# Altium schematic sheet SUMMARY.SchDoc: SUMMARY
size A4; Author: Joao Guimaraes; Organization: Altium Limited; Address1: L3, 12a Rodborough Rd; Address2: Frenchs Forest; Address3: NSW; Address4: Australia 2086; Revision: 1.0.0; SheetNumber: 1
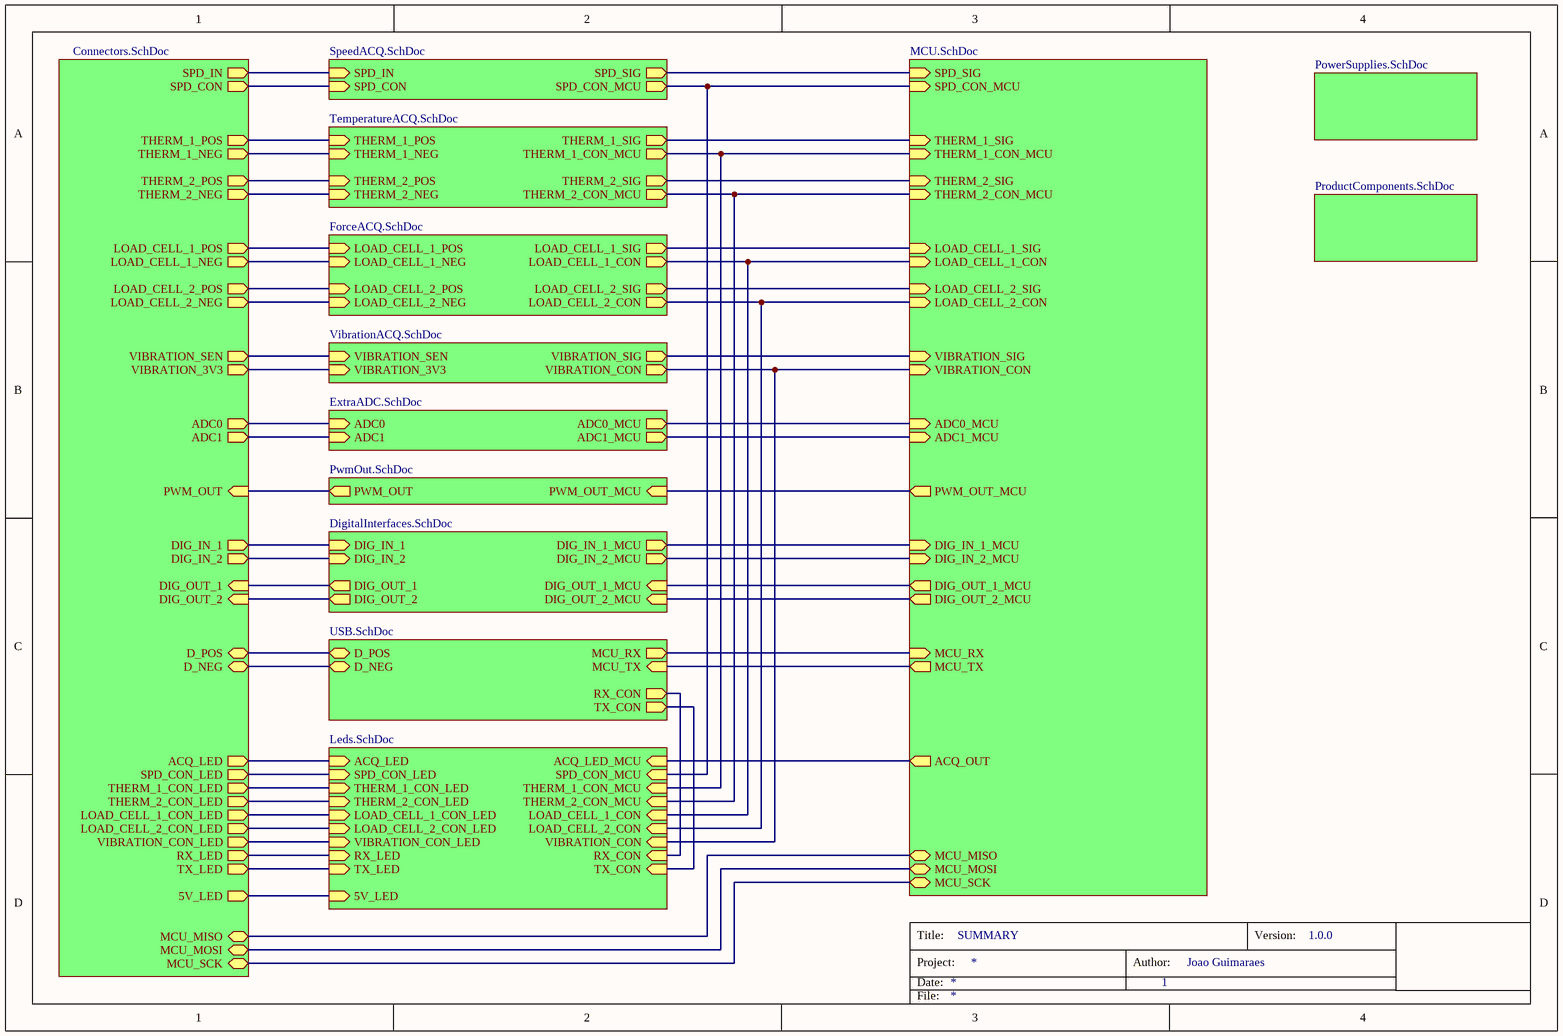
[diagram p0: SUMMARY.SchDoc]

## Sub-sheets
Connectors = Connectors.SchDoc: SPD_IN (out), SPD_CON (out), THERM_1_POS (out), THERM_1_NEG (out), THERM_2_POS (out), THERM_2_NEG (out), LOAD_CELL_1_POS (out), LOAD_CELL_1_NEG (out), LOAD_CELL_2_POS (out), LOAD_CELL_2_NEG (out), VIBRATION_SEN (out), VIBRATION_3V3 (out), DIG_IN_1 (out), DIG_IN_2 (out), DIG_OUT_1 (in), DIG_OUT_2 (in), D_POS, D_NEG, MCU_MISO, MCU_MOSI, MCU_SCK, ACQ_LED (out), RX_LED (out), SPD_CON_LED (out), THERM_1_CON_LED (out), THERM_2_CON_LED (out), LOAD_CELL_1_CON_LED (out), LOAD_CELL_2_CON_LED (out), VIBRATION_CON_LED (out), TX_LED (out), ADC1 (out), PWM_OUT (in), ADC0 (out), 5V_LED (out)
Designator = ExtraADC.SchDoc: ADC0 (in), ADC1 (in), ADC0_MCU (out), ADC1_MCU (out)
DigitalIntefaces = DigitalInterfaces.SchDoc: DIG_IN_1 (in), DIG_IN_2 (in), DIG_OUT_1 (out), DIG_OUT_2 (out), DIG_IN_1_MCU (out), DIG_IN_2_MCU (out), DIG_OUT_1_MCU (in), DIG_OUT_2_MCU (in)
ForceACQ = ForceACQ.SchDoc: LOAD_CELL_1_POS (in), LOAD_CELL_1_NEG (in), LOAD_CELL_2_POS (in), LOAD_CELL_2_NEG (in), LOAD_CELL_1_CON (out), LOAD_CELL_1_SIG (out), LOAD_CELL_2_SIG (out), LOAD_CELL_2_CON (out)
Leds = Leds.SchDoc: ACQ_LED_MCU (in), SPD_CON_MCU (in), THERM_1_CON_MCU (in), THERM_2_CON_MCU (in), LOAD_CELL_1_CON (in), LOAD_CELL_2_CON (in), VIBRATION_CON (in), ACQ_LED (in), SPD_CON_LED (in), THERM_1_CON_LED (in), THERM_2_CON_LED (in), LOAD_CELL_1_CON_LED (in), LOAD_CELL_2_CON_LED (in), VIBRATION_CON_LED (in), RX_CON (in), TX_CON (in), RX_LED (in), TX_LED (in), 5V_LED (in)
MCU = MCU.SchDoc: SPD_SIG (in), SPD_CON_MCU (in), THERM_1_SIG (in), THERM_1_CON_MCU (in), THERM_2_SIG (in), THERM_2_CON_MCU (in), LOAD_CELL_1_SIG (in), LOAD_CELL_1_CON (in), LOAD_CELL_2_SIG (in), LOAD_CELL_2_CON (in), VIBRATION_SIG (in), VIBRATION_CON (in), PWM_OUT_MCU (out), DIG_IN_1_MCU (in), DIG_IN_2_MCU (in), DIG_OUT_1_MCU (out), DIG_OUT_2_MCU (out), MCU_RX (in), MCU_TX (out), MCU_MISO, MCU_MOSI, MCU_SCK, ACQ_OUT (out), ADC0_MCU (in), ADC1_MCU (in)
PowerSupplies = PowerSupplies.SchDoc: no entries
ProductComponents = ProductComponents.SchDoc: no entries
PwmOut = PwmOut.SchDoc: PWM_OUT_MCU (in), PWM_OUT (out)
SpeedACQ = SpeedACQ.SchDoc: SPD_IN (in), SPD_SIG (out), SPD_CON_MCU (out), SPD_CON (in)
TemperatureACQ = TemperatureACQ.SchDoc: THERM_1_NEG (in), THERM_2_POS (in), THERM_2_NEG (in), THERM_1_POS (in), THERM_1_SIG (out), THERM_1_CON_MCU (out), THERM_2_SIG (out), THERM_2_CON_MCU (out)
USB = USB.SchDoc: D_POS, D_NEG, MCU_RX (out), MCU_TX (in), RX_CON (out), TX_CON (out)
VibrationACQ = VibrationACQ.SchDoc: VIBRATION_SEN (in), VIBRATION_3V3 (in), VIBRATION_SIG (out), VIBRATION_CON (out)

## Nets
(unnamed): sheet TemperatureACQ/THERM_1_NEG, sheet Connectors/THERM_1_NEG
(unnamed): sheet TemperatureACQ/THERM_2_POS, sheet Connectors/THERM_2_POS
(unnamed): sheet TemperatureACQ/THERM_2_NEG, sheet Connectors/THERM_2_NEG
(unnamed): sheet TemperatureACQ/THERM_1_POS, sheet Connectors/THERM_1_POS
(unnamed): sheet TemperatureACQ/THERM_1_SIG, sheet MCU/THERM_1_SIG
(unnamed): sheet TemperatureACQ/THERM_1_CON_MCU, sheet MCU/THERM_1_CON_MCU, sheet Leds/THERM_1_CON_MCU
(unnamed): sheet TemperatureACQ/THERM_2_SIG, sheet MCU/THERM_2_SIG
(unnamed): sheet TemperatureACQ/THERM_2_CON_MCU, sheet MCU/THERM_2_CON_MCU, sheet Leds/THERM_2_CON_MCU
(unnamed): sheet ForceACQ/LOAD_CELL_1_POS, sheet Connectors/LOAD_CELL_1_POS
(unnamed): sheet ForceACQ/LOAD_CELL_1_NEG, sheet Connectors/LOAD_CELL_1_NEG
(unnamed): sheet ForceACQ/LOAD_CELL_2_POS, sheet Connectors/LOAD_CELL_2_POS
(unnamed): sheet ForceACQ/LOAD_CELL_2_NEG, sheet Connectors/LOAD_CELL_2_NEG
(unnamed): sheet ForceACQ/LOAD_CELL_1_CON, sheet MCU/LOAD_CELL_1_CON, sheet Leds/LOAD_CELL_1_CON
(unnamed): sheet ForceACQ/LOAD_CELL_1_SIG, sheet MCU/LOAD_CELL_1_SIG
(unnamed): sheet ForceACQ/LOAD_CELL_2_SIG, sheet MCU/LOAD_CELL_2_SIG
(unnamed): sheet ForceACQ/LOAD_CELL_2_CON, sheet MCU/LOAD_CELL_2_CON, sheet Leds/LOAD_CELL_2_CON
(unnamed): sheet VibrationACQ/VIBRATION_SEN, sheet Connectors/VIBRATION_SEN
(unnamed): sheet VibrationACQ/VIBRATION_3V3, sheet Connectors/VIBRATION_3V3
(unnamed): sheet VibrationACQ/VIBRATION_SIG, sheet MCU/VIBRATION_SIG
(unnamed): sheet VibrationACQ/VIBRATION_CON, sheet MCU/VIBRATION_CON, sheet Leds/VIBRATION_CON
(unnamed): sheet SpeedACQ/SPD_IN, sheet Connectors/SPD_IN
(unnamed): sheet SpeedACQ/SPD_SIG, sheet MCU/SPD_SIG
(unnamed): sheet SpeedACQ/SPD_CON_MCU, sheet MCU/SPD_CON_MCU, sheet Leds/SPD_CON_MCU
(unnamed): sheet SpeedACQ/SPD_CON, sheet Connectors/SPD_CON
(unnamed): sheet MCU/PWM_OUT_MCU, sheet PwmOut/PWM_OUT_MCU
(unnamed): sheet MCU/DIG_IN_1_MCU, sheet DigitalIntefaces/DIG_IN_1_MCU
(unnamed): sheet MCU/DIG_IN_2_MCU, sheet DigitalIntefaces/DIG_IN_2_MCU
(unnamed): sheet MCU/DIG_OUT_1_MCU, sheet DigitalIntefaces/DIG_OUT_1_MCU
(unnamed): sheet MCU/DIG_OUT_2_MCU, sheet DigitalIntefaces/DIG_OUT_2_MCU
(unnamed): sheet MCU/MCU_RX, sheet USB/MCU_RX
(unnamed): sheet MCU/MCU_TX, sheet USB/MCU_TX
(unnamed): sheet MCU/MCU_MISO, sheet Connectors/MCU_MISO
(unnamed): sheet MCU/MCU_MOSI, sheet Connectors/MCU_MOSI
(unnamed): sheet MCU/MCU_SCK, sheet Connectors/MCU_SCK
(unnamed): sheet MCU/ACQ_OUT, sheet Leds/ACQ_LED_MCU
(unnamed): sheet MCU/ADC0_MCU, sheet Designator/ADC0_MCU
(unnamed): sheet MCU/ADC1_MCU, sheet Designator/ADC1_MCU
(unnamed): sheet PwmOut/PWM_OUT, sheet Connectors/PWM_OUT
(unnamed): sheet DigitalIntefaces/DIG_IN_1, sheet Connectors/DIG_IN_1
(unnamed): sheet DigitalIntefaces/DIG_IN_2, sheet Connectors/DIG_IN_2
(unnamed): sheet DigitalIntefaces/DIG_OUT_1, sheet Connectors/DIG_OUT_1
(unnamed): sheet DigitalIntefaces/DIG_OUT_2, sheet Connectors/DIG_OUT_2
(unnamed): sheet Connectors/D_POS, sheet USB/D_POS
(unnamed): sheet Connectors/D_NEG, sheet USB/D_NEG
(unnamed): sheet Connectors/ACQ_LED, sheet Leds/ACQ_LED
(unnamed): sheet Connectors/RX_LED, sheet Leds/RX_LED
(unnamed): sheet Connectors/SPD_CON_LED, sheet Leds/SPD_CON_LED
(unnamed): sheet Connectors/THERM_1_CON_LED, sheet Leds/THERM_1_CON_LED
(unnamed): sheet Connectors/THERM_2_CON_LED, sheet Leds/THERM_2_CON_LED
(unnamed): sheet Connectors/LOAD_CELL_1_CON_LED, sheet Leds/LOAD_CELL_1_CON_LED
(unnamed): sheet Connectors/LOAD_CELL_2_CON_LED, sheet Leds/LOAD_CELL_2_CON_LED
(unnamed): sheet Connectors/VIBRATION_CON_LED, sheet Leds/VIBRATION_CON_LED
(unnamed): sheet Connectors/TX_LED, sheet Leds/TX_LED
(unnamed): sheet Connectors/ADC1, sheet Designator/ADC1
(unnamed): sheet Connectors/ADC0, sheet Designator/ADC0
(unnamed): sheet Connectors/5V_LED, sheet Leds/5V_LED
(unnamed): sheet Leds/RX_CON, sheet USB/RX_CON
(unnamed): sheet Leds/TX_CON, sheet USB/TX_CON

## Notes on the sheet
- Title:
- Project:
- Date:
- Author:
- Version:
- File: